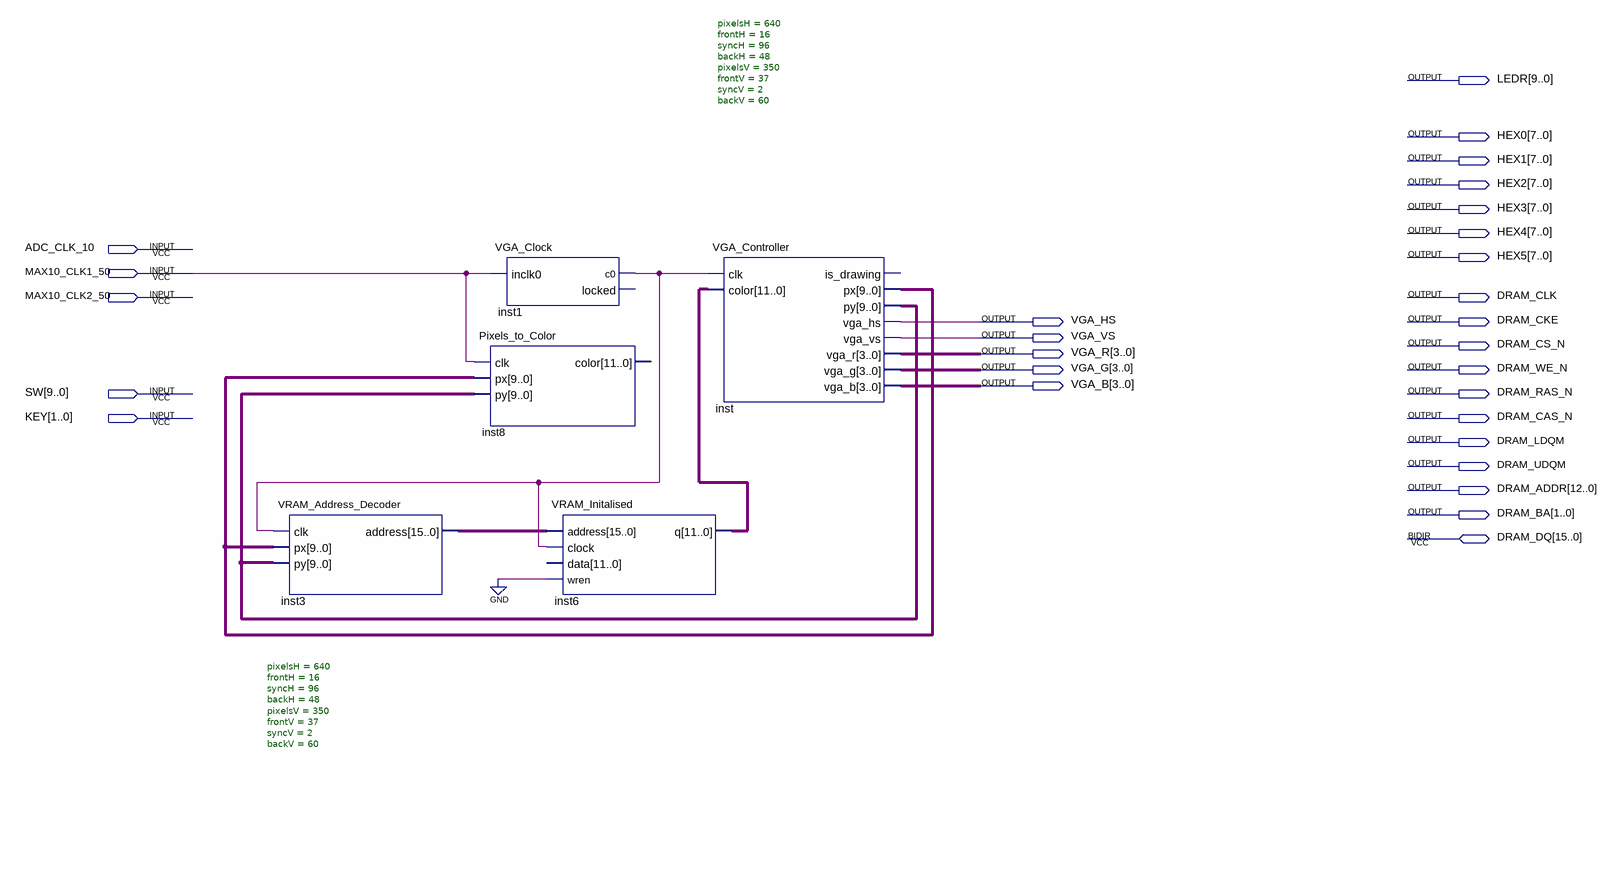
[diagram p0: schematic sheet]
// Quartus schematic TopLevel.bdf as structural Verilog: 5 symbols, 28 pins
module TopLevel (
  input  ADC_CLK_10,
  input  MAX10_CLK1_50,
  input  MAX10_CLK2_50,
  input  [9:0] SW,
  input  [1:0] KEY,
  inout  [15:0] DRAM_DQ,
  output [9:0] LEDR,
  output [7:0] HEX0,
  output [7:0] HEX1,
  output [7:0] HEX2,
  output [7:0] HEX3,
  output [7:0] HEX4,
  output [7:0] HEX5,
  output DRAM_CLK,
  output VGA_HS,
  output DRAM_CKE,
  output VGA_VS,
  output DRAM_CS_N,
  output [3:0] VGA_R,
  output [3:0] VGA_G,
  output DRAM_WE_N,
  output [3:0] VGA_B,
  output DRAM_RAS_N,
  output DRAM_CAS_N,
  output DRAM_LDQM,
  output DRAM_UDQM,
  output [12:0] DRAM_ADDR,
  output [1:0] DRAM_BA
);

  wire inst1_c0;
  wire [9:0] inst_px, inst_py;
  wire [11:0] inst6_q;
  wire [15:0] inst3_address;

  VRAM_Address_Decoder #(.pixelsH(640), .frontH(16), .syncH(96), .backH(48), .pixelsV(350), .frontV(37), .syncV(2), .backV(60)) inst3 (
    .clk(inst1_c0), .px(inst_px), .py(inst_py), .address(inst3_address));
  VGA_Clock inst1 (.inclk0(MAX10_CLK1_50), .c0(inst1_c0));  // open: locked
  Pixels_to_Color inst8 (.clk(MAX10_CLK1_50), .px(inst_px), .py(inst_py));  // open: color
  VRAM_Initalised inst6 (.address(inst3_address), .clock(inst1_c0), .wren(1'b0), .q(inst6_q));  // open: data
  VGA_Controller #(.pixelsH(640), .frontH(16), .syncH(96), .backH(48), .pixelsV(350), .frontV(37), .syncV(2), .backV(60)) inst (
    .clk(inst1_c0), .color(inst6_q), .px(inst_px), .py(inst_py), .vga_hs(VGA_HS), .vga_vs(VGA_VS),
    .vga_r(VGA_R), .vga_g(VGA_G), .vga_b(VGA_B));  // open: is_drawing
endmodule
